# EAGLE schematic p2hex-001 (EAGLE 9.6.2)
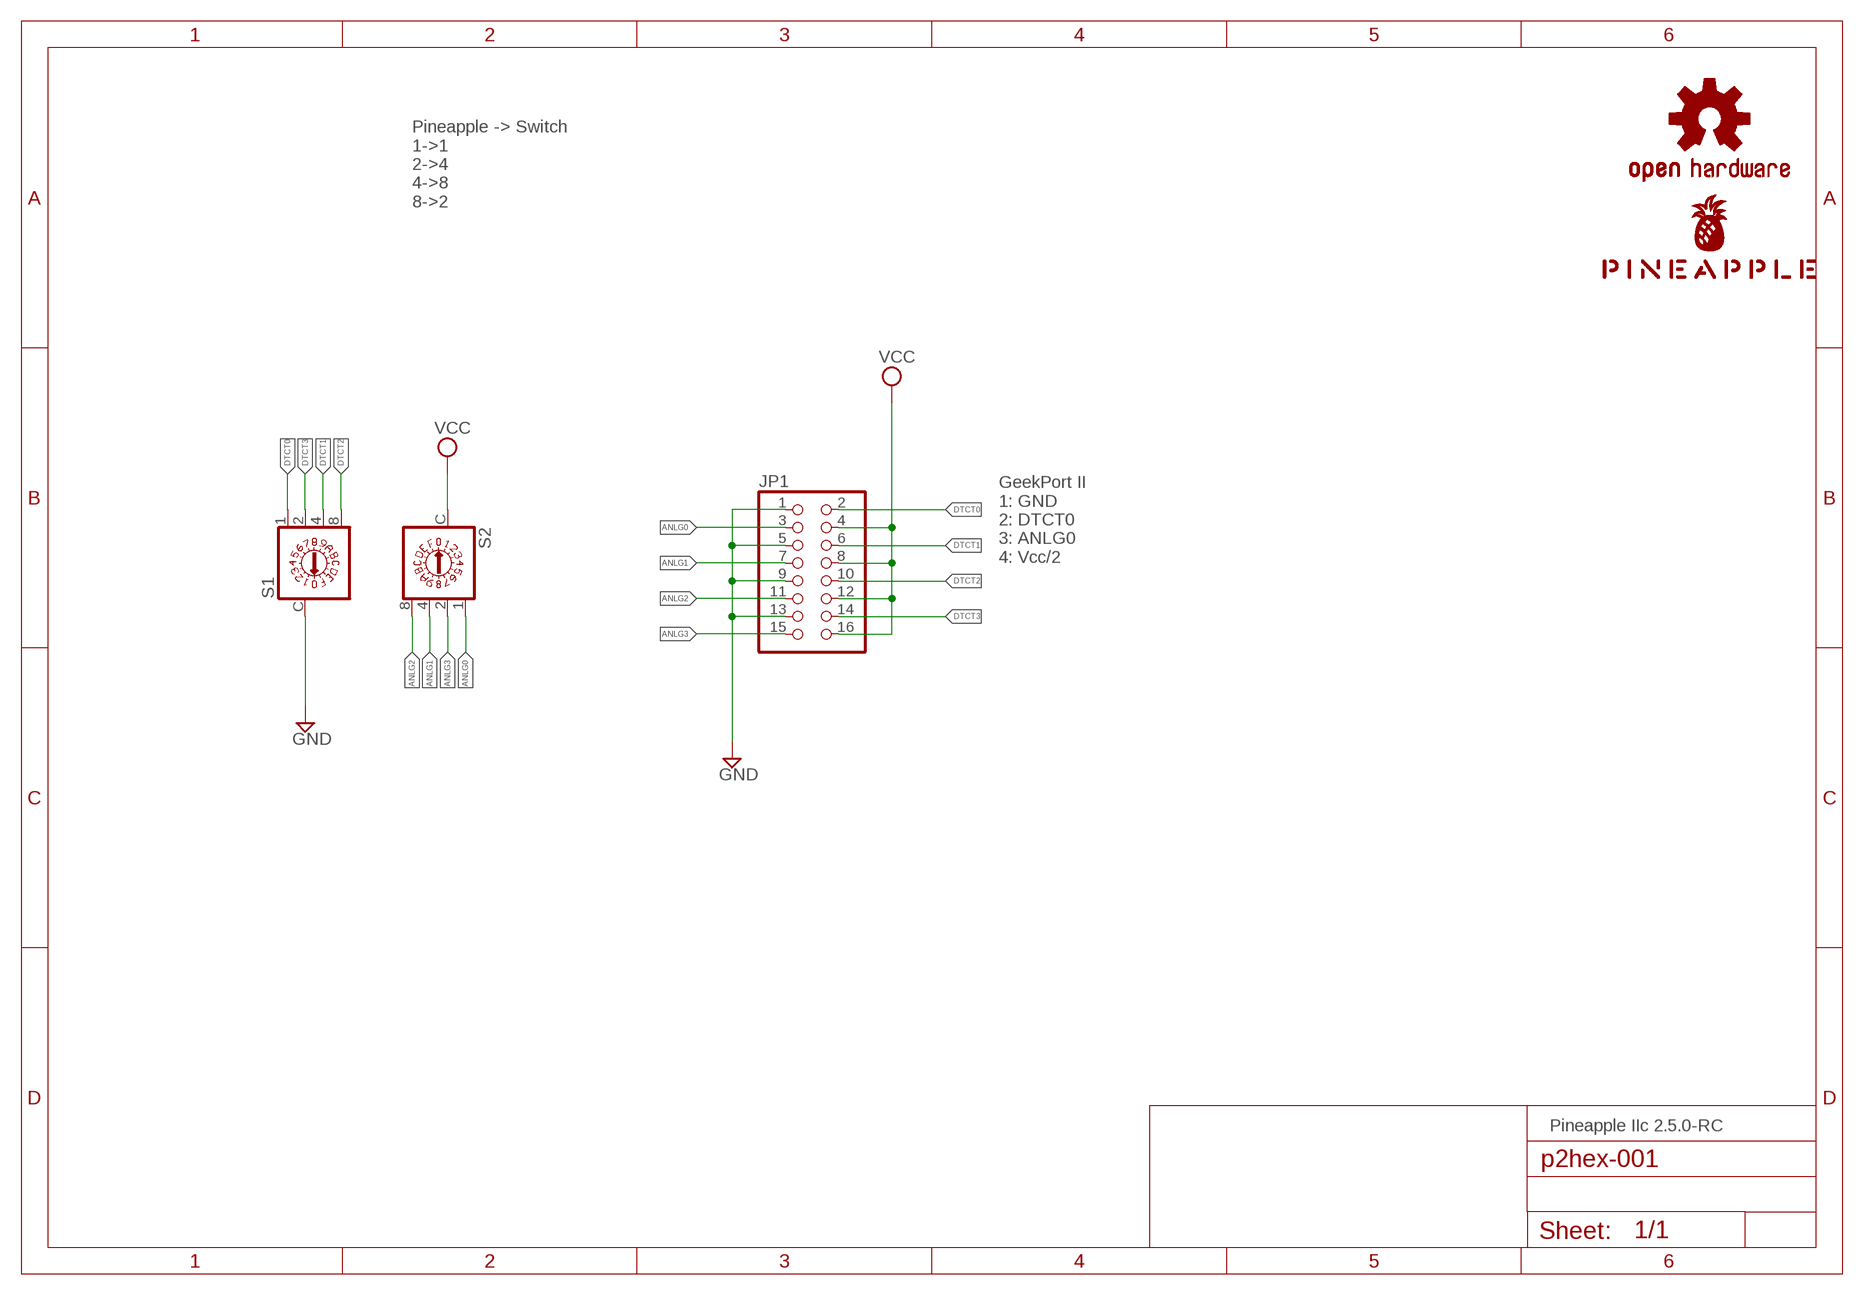
[diagram p0: schematic, sheet 1]

## Parts
JP1  PINHD-2X8  [2X08]
LOGO1  OSHW-LOGOS-COPPER  [OSHW-LOGO-S_COPPER]
S1  A1353HEX  [A1353HEX]
S2  A1353HEX  [A1353HEX]
U$1  PINEAPPLE450_SILK  [PINEAPPLE450_SILK]

## Nets
ANLG0: JP1.3 S2.1
ANLG1: JP1.7 S2.4
ANLG2: JP1.11 S2.8
ANLG3: JP1.15 S2.2
DTCT0: JP1.2 S1.1
DTCT1: JP1.6 S1.4
DTCT2: JP1.10 S1.8
DTCT3: JP1.14 S1.2
GND: JP1.1 JP1.5 JP1.9 JP1.13 S1.C
VCC: JP1.4 JP1.8 JP1.12 JP1.16 S2.C

## Notes on the sheet
- Pineapple -> Switch
  1->1
  2->4
  4->8
  8->2
- GeekPort II
  1: GND
  2: DTCT0
  3: ANLG0
  4: Vcc/2
- Pineapple IIc 2.5.0-RC

## Library data of the parts
JP1 = pinhead:PINHD-2X8: PIN HEADER
LOGO1 = SparkFun-Aesthetics:OSHW-LOGO: Open-Source Hardware (OSHW) Logo This logo indicates the piece of hardware it is found on incorporates a OSHW license and/or adheres to the definition of open source hardware found here: http://freedomdefined.org/OSHW
S1 S2 = switch-dil:A1353HEX: DIL/CODE SWITCH; OC_FARNELL: unknown; OC_NEWARK: unknown
U$1 = pineapple:PINEAPPLE450_SILK

## Net classes
0 default: width 0.152 mm, drill 0.152 mm, clearance 0.152 mm
1 ground: width 0.305 mm, drill 0.152 mm, clearance 0.152 mm
2 power1: width 0.508 mm, drill 0.152 mm, clearance 0.152 mm
3 power2: width 0.61 mm, drill 0.152 mm, clearance 0.152 mm
4 analog: width 0.305 mm, drill 0.152 mm, clearance 0.152 mm
5 external: width 0.152 mm, drill 0.152 mm, clearance 0.152 mm